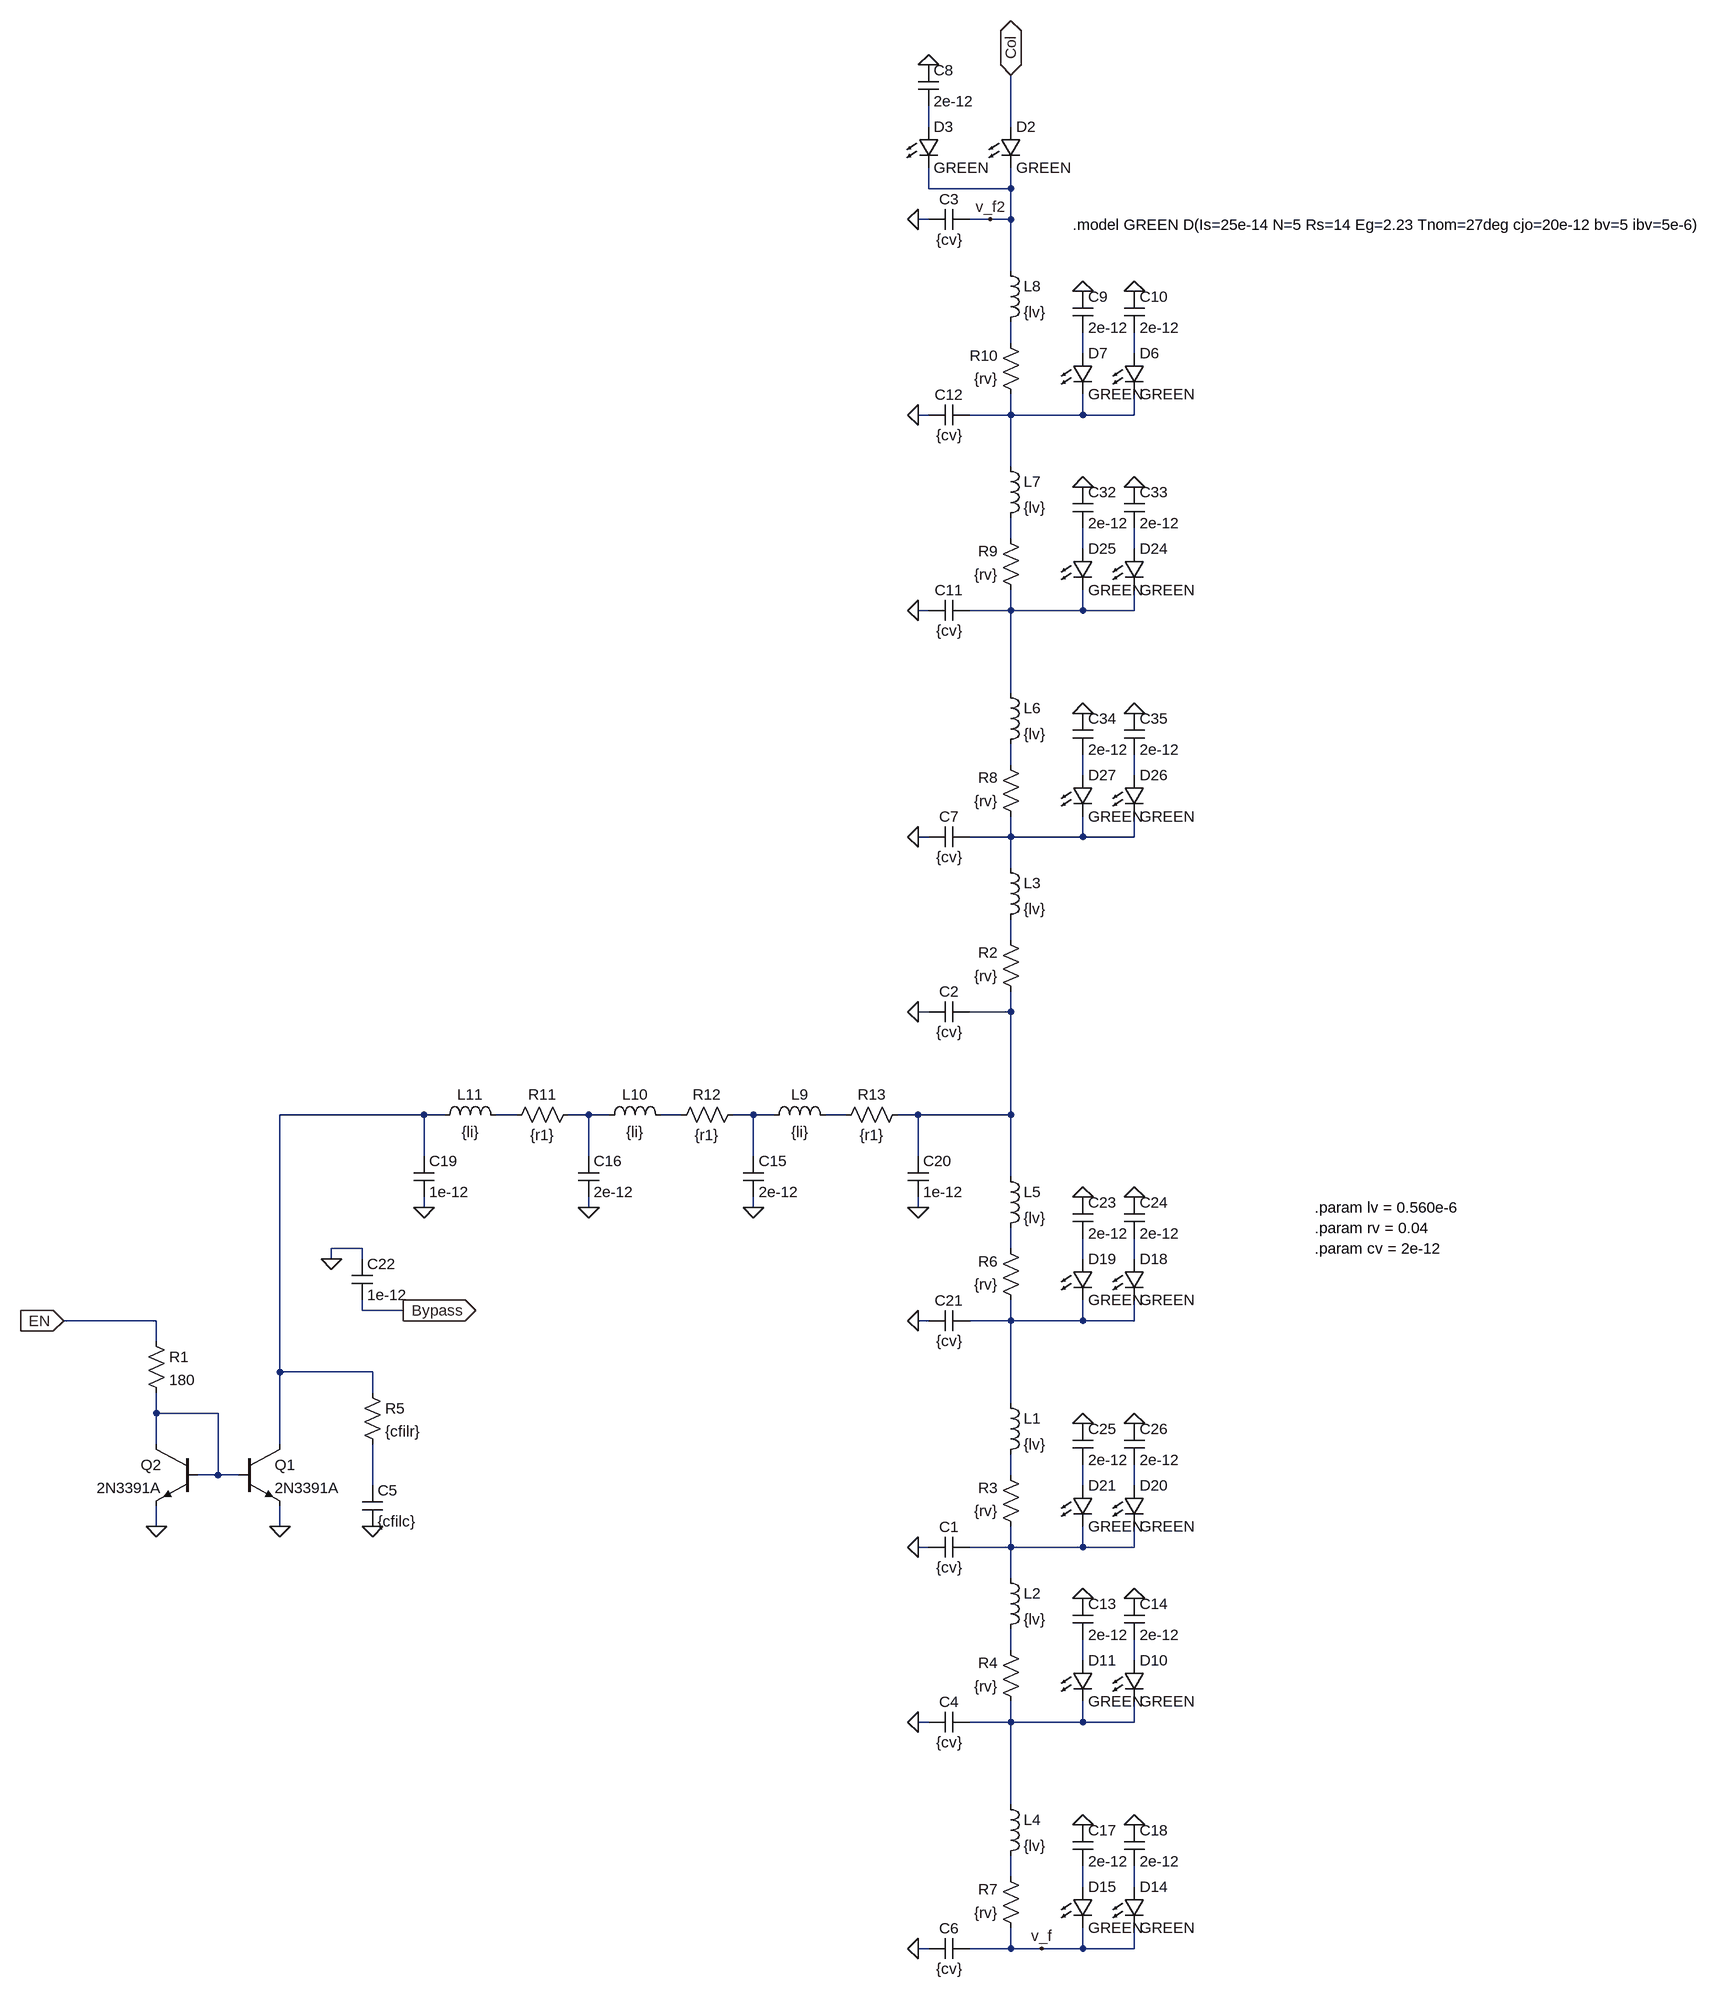
[diagram p0: schematic ColDrv2.asc]
ColDrv2.asc, the LTspice schematic file:
Version 4
SHEET 1 1644 1728
WIRE 256 -1152 256 -1184
WIRE 384 -1152 384 -1232
WIRE 256 -1056 256 -1088
WIRE 384 -1056 384 -1088
WIRE 384 -1056 256 -1056
WIRE 256 -1008 240 -1008
WIRE 352 -1008 320 -1008
WIRE 384 -1008 384 -1056
WIRE 384 -1008 352 -1008
WIRE 384 -928 384 -1008
WIRE 384 -816 384 -848
WIRE 496 -800 496 -832
WIRE 576 -800 576 -832
WIRE 256 -704 240 -704
WIRE 384 -704 384 -736
WIRE 384 -704 320 -704
WIRE 496 -704 496 -736
WIRE 496 -704 384 -704
WIRE 576 -704 576 -736
WIRE 576 -704 496 -704
WIRE 384 -624 384 -704
WIRE 384 -512 384 -544
WIRE 496 -496 496 -528
WIRE 576 -496 576 -528
WIRE 256 -400 240 -400
WIRE 384 -400 384 -432
WIRE 384 -400 320 -400
WIRE 496 -400 496 -432
WIRE 496 -400 384 -400
WIRE 576 -400 576 -432
WIRE 576 -400 496 -400
WIRE 384 -272 384 -400
WIRE 384 -160 384 -192
WIRE 496 -144 496 -176
WIRE 576 -144 576 -176
WIRE 256 -48 240 -48
WIRE 384 -48 384 -80
WIRE 384 -48 320 -48
WIRE 496 -48 496 -80
WIRE 496 -48 384 -48
WIRE 576 -48 576 -80
WIRE 576 -48 496 -48
WIRE 384 0 384 -48
WIRE 384 112 384 80
WIRE 256 224 240 224
WIRE 384 224 384 192
WIRE 384 224 320 224
WIRE -528 384 -752 384
WIRE -496 384 -528 384
WIRE -384 384 -416 384
WIRE -272 384 -304 384
WIRE -240 384 -272 384
WIRE -128 384 -160 384
WIRE -16 384 -48 384
WIRE 16 384 -16 384
WIRE 128 384 96 384
WIRE 240 384 208 384
WIRE 384 384 384 224
WIRE 384 384 240 384
WIRE -528 448 -528 384
WIRE -272 448 -272 384
WIRE -16 448 -16 384
WIRE 240 448 240 384
WIRE 384 480 384 384
WIRE -528 528 -528 512
WIRE -272 528 -272 512
WIRE -16 528 -16 512
WIRE 240 528 240 512
WIRE -624 592 -672 592
WIRE 384 592 384 560
WIRE -672 608 -672 592
WIRE -624 608 -624 592
WIRE 496 608 496 576
WIRE 576 608 576 576
WIRE -624 688 -624 672
WIRE -560 688 -624 688
WIRE -944 704 -1088 704
WIRE 256 704 240 704
WIRE 384 704 384 672
WIRE 384 704 320 704
WIRE 496 704 496 672
WIRE 496 704 384 704
WIRE 576 704 576 672
WIRE 576 704 496 704
WIRE -944 736 -944 704
WIRE -752 784 -752 384
WIRE -608 784 -752 784
WIRE -608 816 -608 784
WIRE 384 832 384 704
WIRE -944 848 -944 816
WIRE -848 848 -944 848
WIRE -944 896 -944 848
WIRE -752 896 -752 784
WIRE -848 944 -848 848
WIRE -848 944 -880 944
WIRE -816 944 -848 944
WIRE 384 944 384 912
WIRE -608 960 -608 896
WIRE 496 960 496 928
WIRE 576 960 576 928
WIRE -944 1024 -944 992
WIRE -752 1024 -752 992
WIRE 256 1056 240 1056
WIRE 384 1056 384 1024
WIRE 384 1056 320 1056
WIRE 496 1056 496 1024
WIRE 496 1056 384 1056
WIRE 576 1056 576 1024
WIRE 576 1056 496 1056
WIRE 384 1104 384 1056
WIRE 384 1216 384 1184
WIRE 496 1232 496 1200
WIRE 576 1232 576 1200
WIRE 256 1328 240 1328
WIRE 384 1328 384 1296
WIRE 384 1328 320 1328
WIRE 496 1328 496 1296
WIRE 496 1328 384 1328
WIRE 576 1328 576 1296
WIRE 576 1328 496 1328
WIRE 384 1456 384 1328
WIRE 384 1568 384 1536
WIRE 496 1584 496 1552
WIRE 576 1584 576 1552
WIRE 256 1680 240 1680
WIRE 384 1680 384 1648
WIRE 384 1680 320 1680
WIRE 432 1680 384 1680
WIRE 496 1680 496 1648
WIRE 496 1680 432 1680
WIRE 576 1680 576 1648
WIRE 576 1680 496 1680
FLAG -752 1024 0
FLAG -944 1024 0
FLAG 240 -1008 0
FLAG -1088 704 EN
IOPIN -1088 704 In
FLAG -560 688 Bypass
IOPIN -560 688 Out
FLAG -608 1024 0
FLAG 384 -1232 Col
IOPIN 384 -1232 BiDir
FLAG 256 -1248 0
FLAG 496 -896 0
FLAG 576 -896 0
FLAG 496 1136 0
FLAG 576 1136 0
FLAG 496 1488 0
FLAG 576 1488 0
FLAG 240 704 0
FLAG 496 512 0
FLAG 576 512 0
FLAG 496 864 0
FLAG 576 864 0
FLAG 496 -592 0
FLAG 576 -592 0
FLAG 496 -240 0
FLAG 576 -240 0
FLAG 432 1680 v_f
FLAG 352 -1008 v_f2
FLAG 240 1056 0
FLAG 240 1328 0
FLAG 240 1680 0
FLAG 240 224 0
FLAG 240 -48 0
FLAG 240 -400 0
FLAG 240 -704 0
FLAG -528 528 0
FLAG -272 528 0
FLAG -16 528 0
FLAG 240 528 0
FLAG -672 608 0
SYMBOL npn -816 896 R0
SYMATTR InstName Q1
SYMATTR Value 2N3391A
SYMBOL npn -880 896 M0
SYMATTR InstName Q2
SYMATTR Value 2N3391A
SYMBOL res -960 720 R0
SYMATTR InstName R1
SYMATTR Value 180
SYMBOL cap 320 -1024 R90
WINDOW 0 0 32 VBottom 0
WINDOW 3 32 32 VTop 0
SYMATTR InstName C3
SYMATTR Value {cv}
SYMBOL LED 368 -1152 R0
SYMATTR InstName D2
SYMATTR Value GREEN
SYMATTR Description Diode
SYMATTR Type diode
SYMBOL res -624 800 R0
SYMATTR InstName R5
SYMATTR Value {cfilr}
SYMBOL cap -624 960 R0
SYMATTR InstName C5
SYMATTR Value {cfilc}
SYMBOL LED 240 -1152 R0
SYMATTR InstName D3
SYMATTR Value GREEN
SYMATTR Description Diode
SYMATTR Type diode
SYMBOL cap 240 -1248 R0
SYMATTR InstName C8
SYMATTR Value 2e-12
SYMBOL LED 560 -800 R0
SYMATTR InstName D6
SYMATTR Value GREEN
SYMATTR Description Diode
SYMATTR Type diode
SYMBOL LED 480 -800 R0
SYMATTR InstName D7
SYMATTR Value GREEN
SYMATTR Description Diode
SYMATTR Type diode
SYMBOL cap 480 -896 R0
SYMATTR InstName C9
SYMATTR Value 2e-12
SYMBOL cap 560 -896 R0
SYMATTR InstName C10
SYMATTR Value 2e-12
SYMBOL LED 560 1232 R0
SYMATTR InstName D10
SYMATTR Value GREEN
SYMATTR Description Diode
SYMATTR Type diode
SYMBOL LED 480 1232 R0
SYMATTR InstName D11
SYMATTR Value GREEN
SYMATTR Description Diode
SYMATTR Type diode
SYMBOL cap 480 1136 R0
SYMATTR InstName C13
SYMATTR Value 2e-12
SYMBOL cap 560 1136 R0
SYMATTR InstName C14
SYMATTR Value 2e-12
SYMBOL LED 560 1584 R0
SYMATTR InstName D14
SYMATTR Value GREEN
SYMATTR Description Diode
SYMATTR Type diode
SYMBOL LED 480 1584 R0
SYMATTR InstName D15
SYMATTR Value GREEN
SYMATTR Description Diode
SYMATTR Type diode
SYMBOL cap 480 1488 R0
SYMATTR InstName C17
SYMATTR Value 2e-12
SYMBOL cap 560 1488 R0
SYMATTR InstName C18
SYMATTR Value 2e-12
SYMBOL res 400 688 R180
WINDOW 0 36 76 Left 0
WINDOW 3 36 40 Left 0
SYMATTR InstName R6
SYMATTR Value {rv}
SYMBOL cap 320 688 R90
WINDOW 0 0 32 VBottom 0
WINDOW 3 32 32 VTop 0
SYMATTR InstName C21
SYMATTR Value {cv}
SYMBOL ind 368 464 R0
SYMATTR InstName L5
SYMATTR Value {lv}
SYMBOL LED 560 608 R0
SYMATTR InstName D18
SYMATTR Value GREEN
SYMATTR Description Diode
SYMATTR Type diode
SYMBOL LED 480 608 R0
SYMATTR InstName D19
SYMATTR Value GREEN
SYMATTR Description Diode
SYMATTR Type diode
SYMBOL cap 480 512 R0
SYMATTR InstName C23
SYMATTR Value 2e-12
SYMBOL cap 560 512 R0
SYMATTR InstName C24
SYMATTR Value 2e-12
SYMBOL LED 560 960 R0
SYMATTR InstName D20
SYMATTR Value GREEN
SYMATTR Description Diode
SYMATTR Type diode
SYMBOL LED 480 960 R0
SYMATTR InstName D21
SYMATTR Value GREEN
SYMATTR Description Diode
SYMATTR Type diode
SYMBOL cap 480 864 R0
SYMATTR InstName C25
SYMATTR Value 2e-12
SYMBOL cap 560 864 R0
SYMATTR InstName C26
SYMATTR Value 2e-12
SYMBOL LED 560 -496 R0
SYMATTR InstName D24
SYMATTR Value GREEN
SYMATTR Description Diode
SYMATTR Type diode
SYMBOL LED 480 -496 R0
SYMATTR InstName D25
SYMATTR Value GREEN
SYMATTR Description Diode
SYMATTR Type diode
SYMBOL cap 480 -592 R0
SYMATTR InstName C32
SYMATTR Value 2e-12
SYMBOL cap 560 -592 R0
SYMATTR InstName C33
SYMATTR Value 2e-12
SYMBOL LED 560 -144 R0
SYMATTR InstName D26
SYMATTR Value GREEN
SYMATTR Description Diode
SYMATTR Type diode
SYMBOL LED 480 -144 R0
SYMATTR InstName D27
SYMATTR Value GREEN
SYMATTR Description Diode
SYMATTR Type diode
SYMBOL cap 480 -240 R0
SYMATTR InstName C34
SYMATTR Value 2e-12
SYMBOL cap 560 -240 R0
SYMATTR InstName C35
SYMATTR Value 2e-12
SYMBOL res 400 1040 R180
WINDOW 0 36 76 Left 0
WINDOW 3 36 40 Left 0
SYMATTR InstName R3
SYMATTR Value {rv}
SYMBOL cap 320 1040 R90
WINDOW 0 0 32 VBottom 0
WINDOW 3 32 32 VTop 0
SYMATTR InstName C1
SYMATTR Value {cv}
SYMBOL ind 368 816 R0
SYMATTR InstName L1
SYMATTR Value {lv}
SYMBOL res 400 1312 R180
WINDOW 0 36 76 Left 0
WINDOW 3 36 40 Left 0
SYMATTR InstName R4
SYMATTR Value {rv}
SYMBOL cap 320 1312 R90
WINDOW 0 0 32 VBottom 0
WINDOW 3 32 32 VTop 0
SYMATTR InstName C4
SYMATTR Value {cv}
SYMBOL ind 368 1088 R0
SYMATTR InstName L2
SYMATTR Value {lv}
SYMBOL res 400 1664 R180
WINDOW 0 36 76 Left 0
WINDOW 3 36 40 Left 0
SYMATTR InstName R7
SYMATTR Value {rv}
SYMBOL cap 320 1664 R90
WINDOW 0 0 32 VBottom 0
WINDOW 3 32 32 VTop 0
SYMATTR InstName C6
SYMATTR Value {cv}
SYMBOL ind 368 1440 R0
SYMATTR InstName L4
SYMATTR Value {lv}
SYMBOL res 400 208 R180
WINDOW 0 36 76 Left 0
WINDOW 3 36 40 Left 0
SYMATTR InstName R2
SYMATTR Value {rv}
SYMBOL cap 320 208 R90
WINDOW 0 0 32 VBottom 0
WINDOW 3 32 32 VTop 0
SYMATTR InstName C2
SYMATTR Value {cv}
SYMBOL ind 368 -16 R0
SYMATTR InstName L3
SYMATTR Value {lv}
SYMBOL res 400 -64 R180
WINDOW 0 36 76 Left 0
WINDOW 3 36 40 Left 0
SYMATTR InstName R8
SYMATTR Value {rv}
SYMBOL cap 320 -64 R90
WINDOW 0 0 32 VBottom 0
WINDOW 3 32 32 VTop 0
SYMATTR InstName C7
SYMATTR Value {cv}
SYMBOL ind 368 -288 R0
SYMATTR InstName L6
SYMATTR Value {lv}
SYMBOL res 400 -416 R180
WINDOW 0 36 76 Left 0
WINDOW 3 36 40 Left 0
SYMATTR InstName R9
SYMATTR Value {rv}
SYMBOL cap 320 -416 R90
WINDOW 0 0 32 VBottom 0
WINDOW 3 32 32 VTop 0
SYMATTR InstName C11
SYMATTR Value {cv}
SYMBOL ind 368 -640 R0
SYMATTR InstName L7
SYMATTR Value {lv}
SYMBOL res 400 -720 R180
WINDOW 0 36 76 Left 0
WINDOW 3 36 40 Left 0
SYMATTR InstName R10
SYMATTR Value {rv}
SYMBOL cap 320 -720 R90
WINDOW 0 0 32 VBottom 0
WINDOW 3 32 32 VTop 0
SYMATTR InstName C12
SYMATTR Value {cv}
SYMBOL ind 368 -944 R0
SYMATTR InstName L8
SYMATTR Value {lv}
SYMBOL res -288 368 R90
WINDOW 0 0 56 VBottom 0
WINDOW 3 32 56 VTop 0
SYMATTR InstName R11
SYMATTR Value {r1}
SYMBOL res -32 368 R90
WINDOW 0 0 56 VBottom 0
WINDOW 3 32 56 VTop 0
SYMATTR InstName R12
SYMATTR Value {r1}
SYMBOL res 224 368 R90
WINDOW 0 0 56 VBottom 0
WINDOW 3 32 56 VTop 0
SYMATTR InstName R13
SYMATTR Value {r1}
SYMBOL cap -32 448 R0
SYMATTR InstName C15
SYMATTR Value 2e-12
SYMBOL cap -288 448 R0
SYMATTR InstName C16
SYMATTR Value 2e-12
SYMBOL cap -544 448 R0
SYMATTR InstName C19
SYMATTR Value 1e-12
SYMBOL cap 224 448 R0
SYMATTR InstName C20
SYMATTR Value 1e-12
SYMBOL ind 0 400 R270
WINDOW 0 32 56 VTop 0
WINDOW 3 5 56 VBottom 0
SYMATTR InstName L9
SYMATTR Value {li}
SYMBOL ind -256 400 R270
WINDOW 0 32 56 VTop 0
WINDOW 3 5 56 VBottom 0
SYMATTR InstName L10
SYMATTR Value {li}
SYMBOL ind -512 400 R270
WINDOW 0 32 56 VTop 0
WINDOW 3 5 56 VBottom 0
SYMATTR InstName L11
SYMATTR Value {li}
SYMBOL cap -640 608 R0
SYMATTR InstName C22
SYMATTR Value 1e-12
TEXT 480 -1000 Left 0 !.model GREEN D(Is=25e-14 N=5 Rs=14 Eg=2.23 Tnom=27deg cjo=20e-12 bv=5 ibv=5e-6)
TEXT 856 528 Left 0 !.param lv = 0.560e-6
TEXT 856 560 Left 0 !.param rv = 0.04
TEXT 856 592 Left 0 !.param cv = 2e-12

The netlist it stands for:
* ColDrv2.asc
Q1 N016 N026 0 0 2N3391A
Q2 N026 N026 0 0 2N3391A
R1 EN N026 180
C3 v_f2 0 {cv}
D2 Col v_f2 GREEN
R5 N016 N028 {cfilr}
C5 N028 0 {cfilc}
D3 N001 v_f2 GREEN
C8 0 N001 2e-12
D6 N004 N005 GREEN
D7 N003 N005 GREEN
C9 0 N003 2e-12
C10 0 N004 2e-12
D10 N034 N035 GREEN
D11 N033 N035 GREEN
C13 0 N033 2e-12
C14 0 N034 2e-12
D14 N038 v_f GREEN
D15 N037 v_f GREEN
C17 0 N037 2e-12
C18 0 N038 2e-12
R6 N025 N022 {rv}
C21 N025 0 {cv}
L5 N015 N022 {lv}
D18 N024 N025 GREEN
D19 N023 N025 GREEN
C23 0 N023 2e-12
C24 0 N024 2e-12
D20 N030 N031 GREEN
D21 N029 N031 GREEN
C25 0 N029 2e-12
C26 0 N030 2e-12
D24 N008 N009 GREEN
D25 N007 N009 GREEN
C32 0 N007 2e-12
C33 0 N008 2e-12
D26 N012 N013 GREEN
D27 N011 N013 GREEN
C34 0 N011 2e-12
C35 0 N012 2e-12
R3 N031 N027 {rv}
C1 N031 0 {cv}
L1 N025 N027 {lv}
R4 N035 N032 {rv}
C4 N035 0 {cv}
L2 N031 N032 {lv}
R7 v_f N036 {rv}
C6 v_f 0 {cv}
L4 N035 N036 {lv}
R2 N015 N014 {rv}
C2 N015 0 {cv}
L3 N013 N014 {lv}
R8 N013 N010 {rv}
C7 N013 0 {cv}
L6 N009 N010 {lv}
R9 N009 N006 {rv}
C11 N009 0 {cv}
L7 N005 N006 {lv}
R10 N005 N002 {rv}
C12 N005 0 {cv}
L8 v_f2 N002 {lv}
R11 N018 N017 {r1}
R12 N020 N019 {r1}
R13 N015 N021 {r1}
C15 N020 0 2e-12
C16 N018 0 2e-12
C19 N016 0 1e-12
C20 N015 0 1e-12
L9 N020 N021 {li}
L10 N018 N019 {li}
L11 N016 N017 {li}
C22 0 Bypass 1e-12
.model D D
.lib standard.dio
.model NPN NPN
.model PNP PNP
.lib standard.bjt
.model GREEN D(Is=25e-14 N=5 Rs=14 Eg=2.23 Tnom=27deg cjo=20e-12 bv=5 ibv=5e-6)
.param lv = 0.560e-6
.param rv = 0.04
.param cv = 2e-12
.backanno
.end